# EAGLE design BIM Test Shield (EAGLE 5.12)
AUTHORNAME: Aaron Bonnell-Kangas; BOARDNAME: BIM Test Shield; BOM: EXCLUDE; DATABASE: ../../../../Component libraries/partsdb.txt; RELEASE: RELEASE; REVISIONDATE: v1.0.0 - 2015-04-29; TP_NAME: 4-VBAT

## Sheet 1 of 2
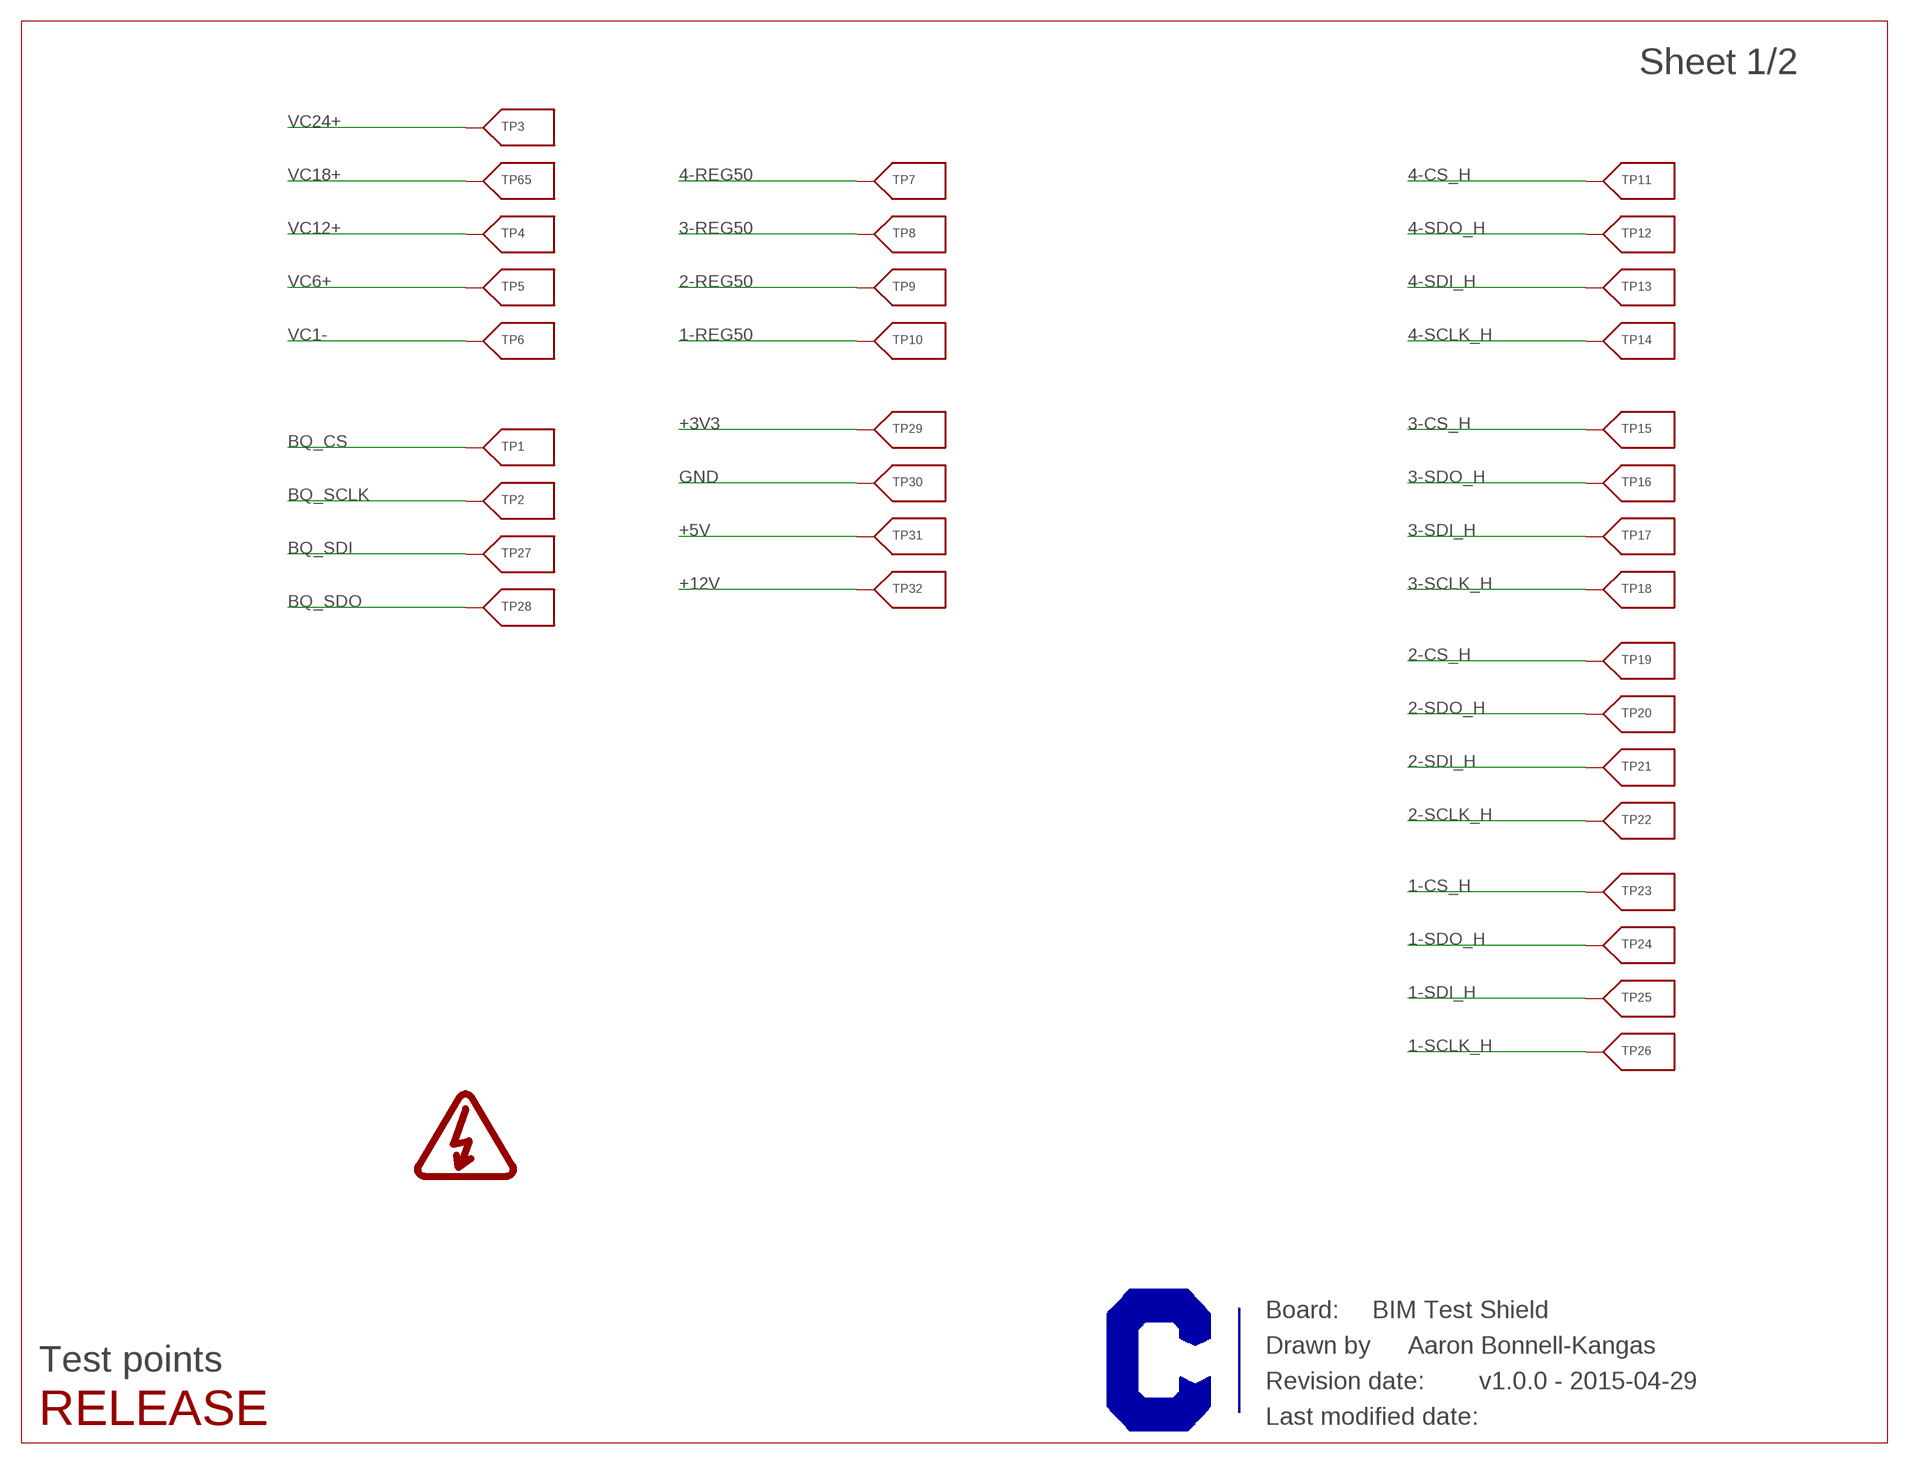
[diagram p0: schematic, sheet 1]

### Parts
TP1  SMD_TEST_POINT-POGO_PIN  [POGO-PIN_MILL-MAX_0908-X]
TP2  SMD_TEST_POINT-POGO_PIN  [POGO-PIN_MILL-MAX_0908-X]
TP3  SMD_TEST_POINT-POGO_PIN  [POGO-PIN_MILL-MAX_0908-X]
TP4  SMD_TEST_POINT-POGO_PIN  [POGO-PIN_MILL-MAX_0908-X]
TP5  SMD_TEST_POINT-POGO_PIN  [POGO-PIN_MILL-MAX_0908-X]
TP6  SMD_TEST_POINT-POGO_PIN  [POGO-PIN_MILL-MAX_0908-X]
TP7  SMD_TEST_POINT-POGO_PIN  [POGO-PIN_MILL-MAX_0908-X]
TP8  SMD_TEST_POINT-POGO_PIN  [POGO-PIN_MILL-MAX_0908-X]
TP9  SMD_TEST_POINT-POGO_PIN  [POGO-PIN_MILL-MAX_0908-X]
TP10  SMD_TEST_POINT-POGO_PIN  [POGO-PIN_MILL-MAX_0908-X]
TP11  SMD_TEST_POINT-POGO_PIN  [POGO-PIN_MILL-MAX_0908-X]
TP12  SMD_TEST_POINT-POGO_PIN  [POGO-PIN_MILL-MAX_0908-X]
TP13  SMD_TEST_POINT-POGO_PIN  [POGO-PIN_MILL-MAX_0908-X]
TP14  SMD_TEST_POINT-POGO_PIN  [POGO-PIN_MILL-MAX_0908-X]
TP15  SMD_TEST_POINT-POGO_PIN  [POGO-PIN_MILL-MAX_0908-X]
TP16  SMD_TEST_POINT-POGO_PIN  [POGO-PIN_MILL-MAX_0908-X]
TP17  SMD_TEST_POINT-POGO_PIN  [POGO-PIN_MILL-MAX_0908-X]
TP18  SMD_TEST_POINT-POGO_PIN  [POGO-PIN_MILL-MAX_0908-X]
TP19  SMD_TEST_POINT-POGO_PIN  [POGO-PIN_MILL-MAX_0908-X]
TP20  SMD_TEST_POINT-POGO_PIN  [POGO-PIN_MILL-MAX_0908-X]
TP21  SMD_TEST_POINT-POGO_PIN  [POGO-PIN_MILL-MAX_0908-X]
TP22  SMD_TEST_POINT-POGO_PIN  [POGO-PIN_MILL-MAX_0908-X]
TP23  SMD_TEST_POINT-POGO_PIN  [POGO-PIN_MILL-MAX_0908-X]
TP24  SMD_TEST_POINT-POGO_PIN  [POGO-PIN_MILL-MAX_0908-X]
TP25  SMD_TEST_POINT-POGO_PIN  [POGO-PIN_MILL-MAX_0908-X]
TP26  SMD_TEST_POINT-POGO_PIN  [POGO-PIN_MILL-MAX_0908-X]
TP27  SMD_TEST_POINT-POGO_PIN  [POGO-PIN_MILL-MAX_0908-X]
TP28  SMD_TEST_POINT-POGO_PIN  [POGO-PIN_MILL-MAX_0908-X]
TP29  SMD_TEST_POINT-POGO_PIN  [POGO-PIN_MILL-MAX_0908-X]
TP30  SMD_TEST_POINT-POGO_PIN  [POGO-PIN_MILL-MAX_0908-X]
TP31  SMD_TEST_POINT-POGO_PIN  [POGO-PIN_MILL-MAX_0908-X]
TP32  SMD_TEST_POINT-POGO_PIN  [POGO-PIN_MILL-MAX_0908-X]
TP65  SMD_TEST_POINT-POGO_PIN  [POGO-PIN_MILL-MAX_0908-X]
U$1  HV_SYMBOL  [HV_SYMBOL]

### Nets
1-CS_H: TP23.P$1 ; also sheet 2
1-REG50: TP10.P$1 ; also sheet 2
1-SCLK_H: TP26.P$1 ; also sheet 2
1-SDI_H: TP25.P$1 ; also sheet 2
1-SDO_H: TP24.P$1 ; also sheet 2
2-CS_H: TP19.P$1 ; also sheet 2
2-REG50: TP9.P$1 ; also sheet 2
2-SCLK_H: TP22.P$1 ; also sheet 2
2-SDI_H: TP21.P$1 ; also sheet 2
2-SDO_H: TP20.P$1 ; also sheet 2
3-CS_H: TP15.P$1 ; also sheet 2
3-REG50: TP8.P$1 ; also sheet 2
3-SCLK_H: TP18.P$1 ; also sheet 2
3-SDI_H: TP17.P$1 ; also sheet 2
3-SDO_H: TP16.P$1 ; also sheet 2
4-CS_H: TP11.P$1 ; also sheet 2
4-REG50: TP7.P$1 ; also sheet 2
4-SCLK_H: TP14.P$1 ; also sheet 2
4-SDI_H: TP13.P$1 ; also sheet 2
4-SDO_H: TP12.P$1 ; also sheet 2
+3V3 [LV]: TP29.P$1 ; also sheet 2
+5V: TP31.P$1 ; also sheet 2
+12V: TP32.P$1 ; also sheet 2
BQ_CS: TP1.P$1 ; also sheet 2
BQ_SCLK: TP2.P$1 ; also sheet 2
BQ_SDI: TP27.P$1 ; also sheet 2
BQ_SDO: TP28.P$1 ; also sheet 2
GND [LV]: TP30.P$1 ; also sheet 2
VC1- [HV]: TP6.P$1 ; also sheet 2
VC6+ [HV]: TP5.P$1 ; also sheet 2
VC12+ [HV]: TP4.P$1 ; also sheet 2
VC18+: TP65.P$1 ; also sheet 2
VC24+ [HV]: TP3.P$1 ; also sheet 2

### Notes on the sheet
- BIM Test Shield
- Aaron Bonnell-Kangas
- Test points
- v1.0.0 - 2015-04-29

## Sheet 2 of 2
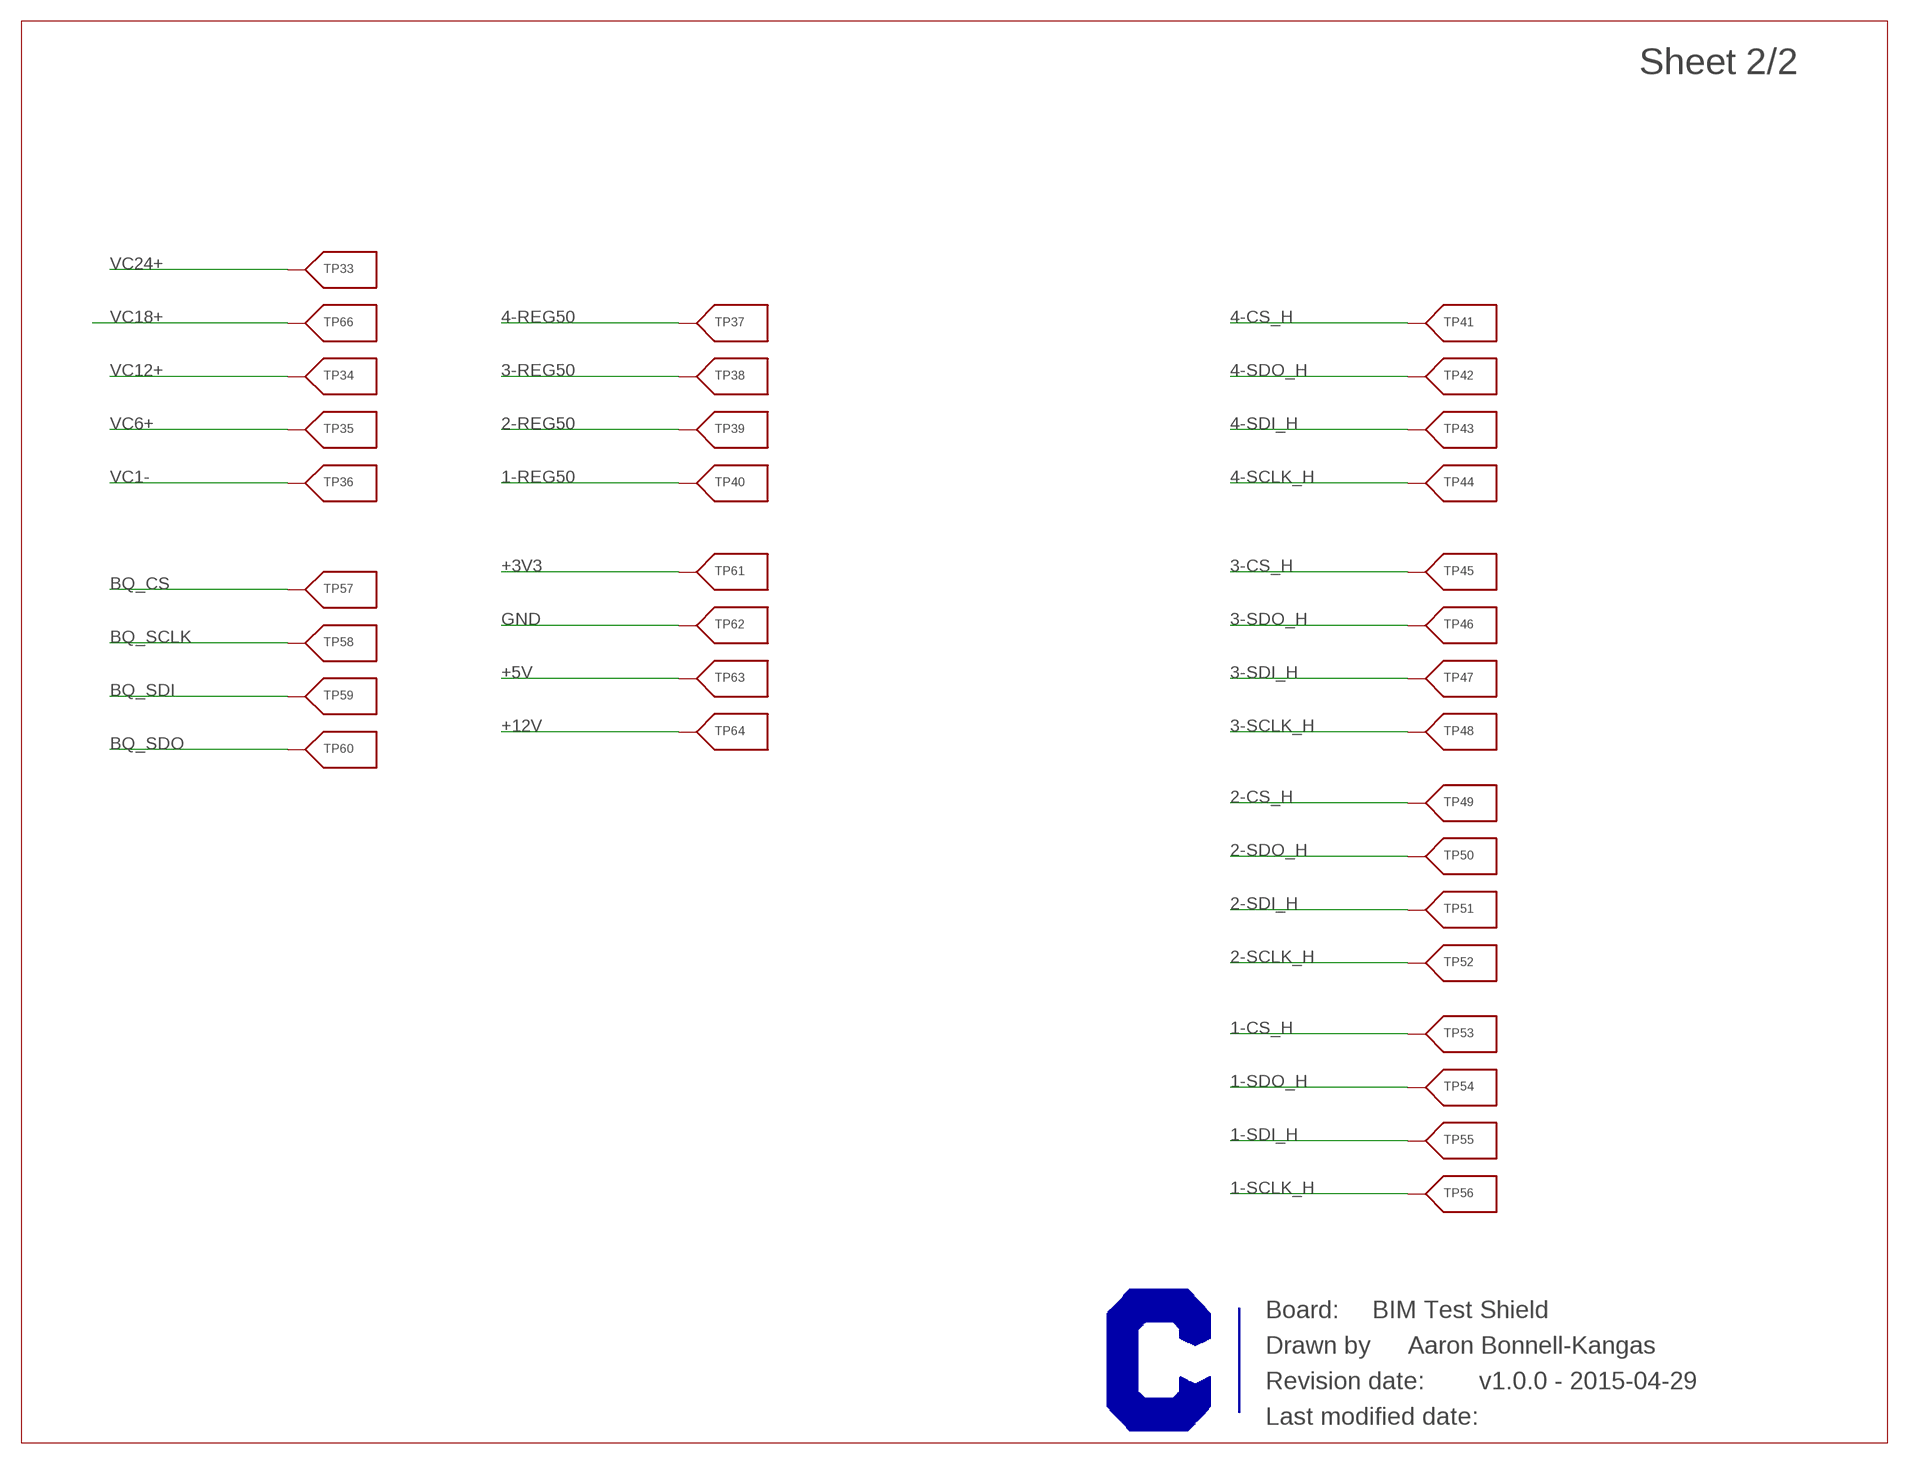
[diagram p1: schematic, sheet 2]

### Parts
TP33  VC24+  SMD_TEST_POINT-TEST_CLIP  [MINI_TEST_POINT]
TP34  VC12+  SMD_TEST_POINT-TEST_CLIP  [MINI_TEST_POINT]
TP35  VC6+  SMD_TEST_POINT-TEST_CLIP  [MINI_TEST_POINT]
TP36  VC1-  SMD_TEST_POINT-TEST_CLIP  [MINI_TEST_POINT]
TP37  4-REG50  SMD_TEST_POINT-TEST_CLIP  [MINI_TEST_POINT]
TP38  3-REG50  SMD_TEST_POINT-TEST_CLIP  [MINI_TEST_POINT]
TP39  2-REG50  SMD_TEST_POINT-TEST_CLIP  [MINI_TEST_POINT]
TP40  1-REG50  SMD_TEST_POINT-TEST_CLIP  [MINI_TEST_POINT]
TP41  4-CS_H  SMD_TEST_POINT-TEST_CLIP  [MINI_TEST_POINT]
TP42  4-SDO_H  SMD_TEST_POINT-TEST_CLIP  [MINI_TEST_POINT]
TP43  4-SDI_H  SMD_TEST_POINT-TEST_CLIP  [MINI_TEST_POINT]
TP44  4-SCLK_H  SMD_TEST_POINT-TEST_CLIP  [MINI_TEST_POINT]
TP45  3-CS_H  SMD_TEST_POINT-TEST_CLIP  [MINI_TEST_POINT]
TP46  3-SDO_H  SMD_TEST_POINT-TEST_CLIP  [MINI_TEST_POINT]
TP47  3_SDI_H  SMD_TEST_POINT-TEST_CLIP  [MINI_TEST_POINT]
TP48  3-SCLK_H  SMD_TEST_POINT-TEST_CLIP  [MINI_TEST_POINT]
TP49  2-CS_H  SMD_TEST_POINT-TEST_CLIP  [MINI_TEST_POINT]
TP50  2-SDO_H  SMD_TEST_POINT-TEST_CLIP  [MINI_TEST_POINT]
TP51  2-SDI_H  SMD_TEST_POINT-TEST_CLIP  [MINI_TEST_POINT]
TP52  2-SCLK_H  SMD_TEST_POINT-TEST_CLIP  [MINI_TEST_POINT]
TP53  1-CS_H  SMD_TEST_POINT-TEST_CLIP  [MINI_TEST_POINT]
TP54  1-SDO_H  SMD_TEST_POINT-TEST_CLIP  [MINI_TEST_POINT]
TP55  1-SDI_H  SMD_TEST_POINT-TEST_CLIP  [MINI_TEST_POINT]
TP56  1-SCLK_H  SMD_TEST_POINT-TEST_CLIP  [MINI_TEST_POINT]
TP57  BQ_CS  SMD_TEST_POINT-TEST_CLIP  [MINI_TEST_POINT]
TP58  BQ_SCLK  SMD_TEST_POINT-TEST_CLIP  [MINI_TEST_POINT]
TP59  BQ_SDI  SMD_TEST_POINT-TEST_CLIP  [MINI_TEST_POINT]
TP60  BQ_SDO  SMD_TEST_POINT-TEST_CLIP  [MINI_TEST_POINT]
TP61  +3V3  SMD_TEST_POINT-TEST_CLIP  [MINI_TEST_POINT]
TP62  GND  SMD_TEST_POINT-TEST_CLIP  [MINI_TEST_POINT]
TP63  +5V  SMD_TEST_POINT-TEST_CLIP  [MINI_TEST_POINT]
TP64  +12V  SMD_TEST_POINT-TEST_CLIP  [MINI_TEST_POINT]
TP66  VC18+  SMD_TEST_POINT-TEST_CLIP  [MINI_TEST_POINT]

### Nets
1-CS_H: TP53.P$1 ; also sheet 1
1-REG50: TP40.P$1 ; also sheet 1
1-SCLK_H: TP56.P$1 ; also sheet 1
1-SDI_H: TP55.P$1 ; also sheet 1
1-SDO_H: TP54.P$1 ; also sheet 1
2-CS_H: TP49.P$1 ; also sheet 1
2-REG50: TP39.P$1 ; also sheet 1
2-SCLK_H: TP52.P$1 ; also sheet 1
2-SDI_H: TP51.P$1 ; also sheet 1
2-SDO_H: TP50.P$1 ; also sheet 1
3-CS_H: TP45.P$1 ; also sheet 1
3-REG50: TP38.P$1 ; also sheet 1
3-SCLK_H: TP48.P$1 ; also sheet 1
3-SDI_H: TP47.P$1 ; also sheet 1
3-SDO_H: TP46.P$1 ; also sheet 1
4-CS_H: TP41.P$1 ; also sheet 1
4-REG50: TP37.P$1 ; also sheet 1
4-SCLK_H: TP44.P$1 ; also sheet 1
4-SDI_H: TP43.P$1 ; also sheet 1
4-SDO_H: TP42.P$1 ; also sheet 1
+3V3 [LV]: TP61.P$1 ; also sheet 1
+5V: TP63.P$1 ; also sheet 1
+12V: TP64.P$1 ; also sheet 1
BQ_CS: TP57.P$1 ; also sheet 1
BQ_SCLK: TP58.P$1 ; also sheet 1
BQ_SDI: TP59.P$1 ; also sheet 1
BQ_SDO: TP60.P$1 ; also sheet 1
GND [LV]: TP62.P$1 ; also sheet 1
VC1- [HV]: TP36.P$1 ; also sheet 1
VC6+ [HV]: TP35.P$1 ; also sheet 1
VC12+ [HV]: TP34.P$1 ; also sheet 1
VC18+: TP66.P$1 ; also sheet 1
VC24+ [HV]: TP33.P$1 ; also sheet 1

### Notes on the sheet
- BIM Test Shield
- Aaron Bonnell-Kangas
- v1.0.0 - 2015-04-29

## Library data of the parts
TP1-TP32 TP65 = Test points:SMD_TEST_POINT; PARTNO: 0908-2-15-20-75-14-11-0
TP33-TP64 TP66 = Test points:SMD_TEST_POINT
U$1 = Logos:HV_SYMBOL; BOM: EXCLUDE

## Net classes
1 HV: clearance 0.1 mm
2 LV: clearance 1 mm to class 1

## Board
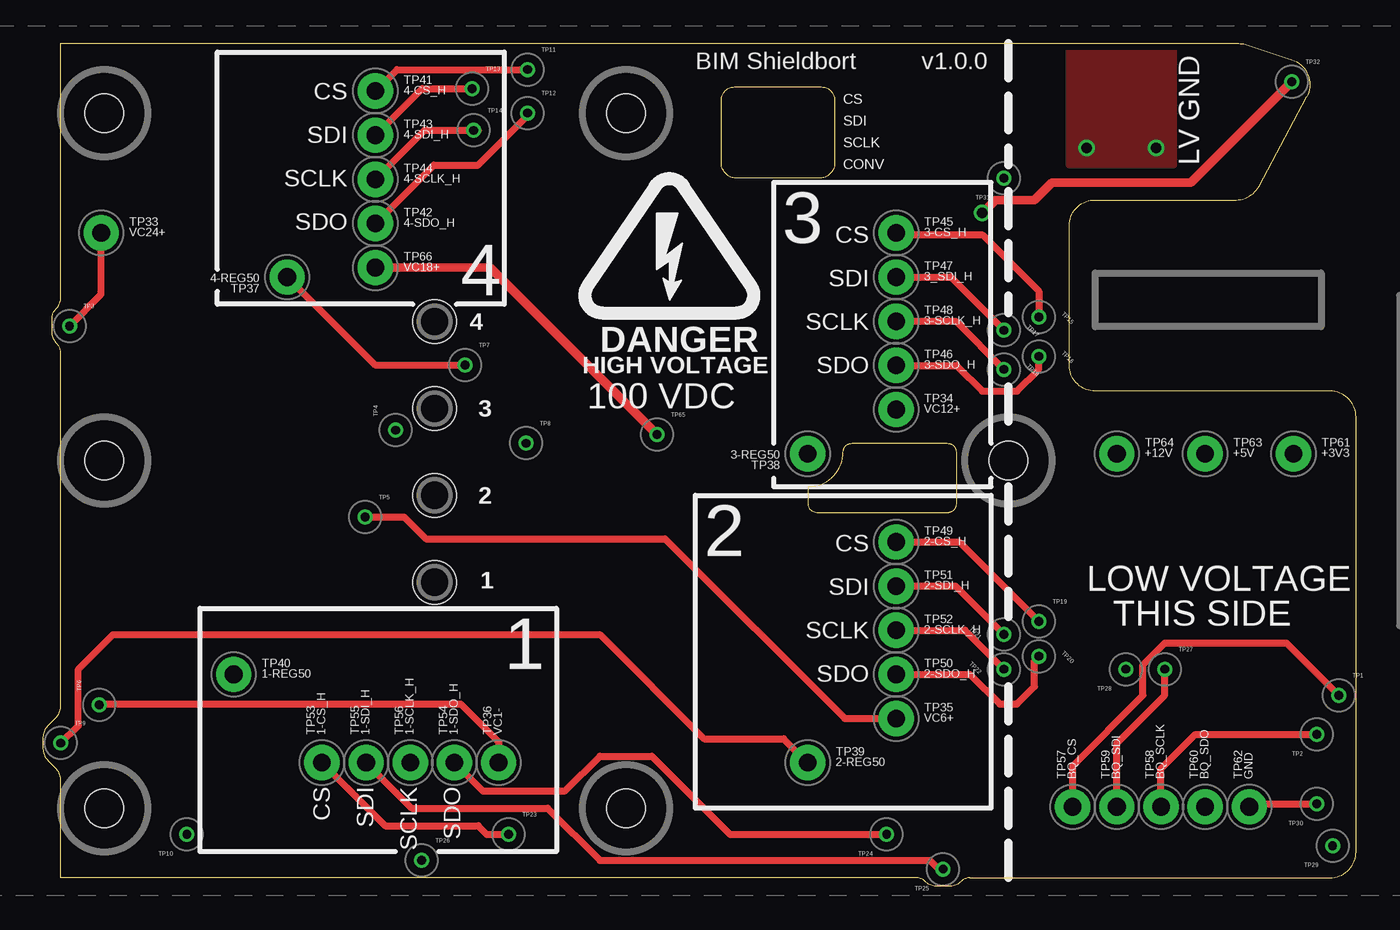
[diagram p2: board, top side]
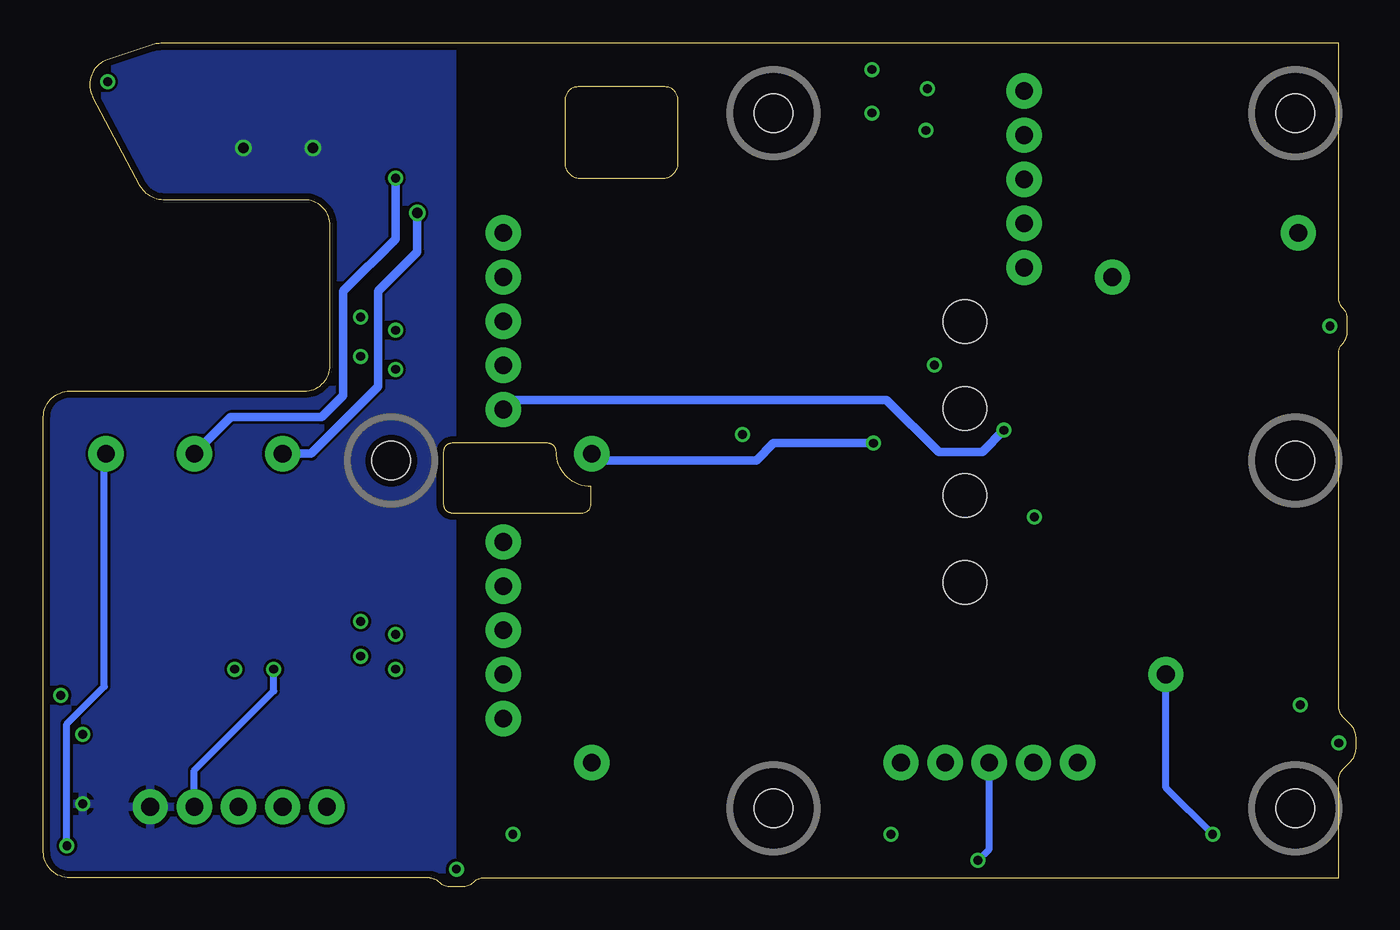
[diagram p3: board, bottom side, seen from below]

Size 75.5 x 48.5 mm. Coordinates in mm from the lower left corner, seen from the top.
Outline: 1,48.5 68.76,48.5 arc-18 69.23,48.42 71.81,47.56 arc-100 72.66,45.43 69.92,40.29 arc-62 68.6,39.5 60.5,39.5 arc90 59,38 59,30 arc90 60.5,28.5 74,28.5 arc-90 75.5,27 75.5,2 arc-90 74,0.5 53.29,0.5 arc45 52.79,0.29 arc-45 52.09,0 51.41,0 arc-45 50.71,0.29 arc45 50.21,0.5 1,0.5 1,6.09 arc45 0.71,6.79 0.29,7.21 arc-45 0,7.91 0,8.59 arc-45 0.29,9.29 0.71,9.71 arc45 1,10.41 1,30.71 arc45 0.79,31.21 arc-45 0.5,31.91 0.5,32.71 arc-45 0.71,33.21 arc45 1,33.91 1,48.5
Outline: 44,23 arc90 46,25 arc-90 46.5,25.5 52,25.5 arc-90 52.5,25 52.5,22 arc-90 52,21.5 44.5,21.5 arc-90 44,22 44,23
Outline: 45.5,41.75 arc-90 44.75,40.75 39.75,40.75 arc-90 39,41.75 39,45.25 arc-90 39.75,46 44.75,46 arc-90 45.5,45.25 45.5,41.75
Copper layers (1*16): Top 0.0356mm / dielectric 1.5011mm / Bottom 0.0356mm
Design rules "OSH Park 2-layer": minimum track width 6mil, minimum drill 13mil, track to track 6mil, track to pad 6mil, pad to pad 6mil, via to via 6mil, smd to smd 6mil, copper to edge 15mil, drill to drill 6mil, minimum pad ring 7mil, minimum via ring 7mil, stop-mask expansion 4mil, vias tented up to drill 25mil, thermal gap 10mil
Holes 2.2 mm at 55.5,24.5 3.5,4.5 3.5,44.5 3.5,24.5 33.5,44.5 33.5,4.5
Holes 2.5 mm at 22.5,27.5 22.5,22.5 22.5,17.5 22.5,32.5
tKeepout: area -17,48.2 to 45.5,49.5; area -17,-0.5 to 45.5,0.8; area 85.5,36 to 90.5,49.5; area 85.5,-0.5 to 90.5,13
bKeepout: area 53,22 to 58,27; area 31.5,2.5 to 35.5,6.5; area 1,2 to 6,7; area 1,42 to 6,47; area 1.5,22.5 to 5.5,26.5; area 31.5,42.5 to 35.5,46.5

### Footprints (pad centres in the part's own frame; a part is rotated, then mirrored left to right if it is on the bottom)
POGO-PIN_MILL-MAX_0908-X = drill 0.508 round: P$1 0,0
MINI_TEST_POINT = drill 1.016 pad 2.032 round: P$1 0,0

### Placement (x,y rotation side)
TP1  74.5,11 0 top
TP2  73.25,8.75 180 top
TP3  1.5,32.25 0 top
TP4  20.25,26.25 90 top
TP5  18.5,21.25 0 top
TP6  3.2,10.45 90 top
TP7  24.25,30 0 top
TP8  27.75,25.5 0 top
TP9  1,8.25 0 top
TP10  8.25,3 180 top
TP11  27.85,47 0 top
TP12  27.85,44.5 0 top
TP13  24.65,45.9 0 top
TP14  24.75,43.5 0 top
TP15  57.25,32.75 315 top
TP16  57.25,30.5 315 top
TP17  55.25,32 315 top
TP18  55.25,29.75 315 top
TP19  57.25,15.25 0 top
TP20  57.25,13.25 315 top
TP21  55.25,14.5 135 top
TP22  55.25,12.5 135 top
TP23  26.75,3 0 top
TP24  48.5,3 180 top
TP25  51.75,1 180 top
TP26  21.75,1.5 0 top
TP27  64.5,12.5 0 top
TP28  62.25,12.5 180 top
TP29  74.15,2.35 180 top
TP30  73.25,4.75 180 top
TP31  55.25,40.75 180 top
TP32  71.8,46.3 0 top
TP33  3.32,37.6 0 top
TP34  49.04,27.44 0 top
TP35  49.04,9.66 0 top
TP36  26.18,7.12 90 top
TP37  14.02,35.06 180 top
TP38  43.96,24.9 180 top
TP39  43.96,7.12 0 top
TP40  10.94,12.2 0 top
TP41  19.1,45.76 0 top
TP42  19.1,38.14 0 top
TP43  19.1,43.22 0 top
TP44  19.1,40.68 0 top
TP45  49.04,37.6 0 top
TP46  49.04,29.98 0 top
TP47  49.04,35.06 0 top
TP48  49.04,32.52 0 top
TP49  49.04,19.82 0 top
TP50  49.04,12.2 0 top
TP51  49.04,17.28 0 top
TP52  49.04,14.74 0 top
TP53  16.02,7.12 90 top
TP54  23.64,7.12 90 top
TP55  18.56,7.12 90 top
TP56  21.1,7.12 90 top
TP57  59.2,4.58 90 top
TP58  64.28,4.58 90 top
TP59  61.74,4.58 90 top
TP60  66.82,4.58 90 top
TP61  71.9,24.9 0 top
TP62  69.36,4.58 90 top
TP63  66.82,24.9 0 top
TP64  61.74,24.9 0 top
TP65  35.3,26 0 top
TP66  19.1,35.6 0 top
U$1  36,38 0 top

### Tracks (layer width: path | path; a pad name or v marks a point on that pad's centre or on a via)
1-CS_H
  Top 0.406: TP53.P$1 19.64,3.5 25,3.5 25.5,3 TP23.P$1
1-REG50
  Bottom 0.406: TP10.P$1 10.94,5.69 TP40.P$1
1-SCLK_H
  Bottom 0.406: TP26.P$1 21.1,2.15 TP56.P$1
1-SDI_H
  Top 0.406: TP55.P$1 21.18,4.5 29,4.5 32,1.5 51,1.5 51.5,1 TP25.P$1
1-SDO_H
  Top 0.406: TP54.P$1 25.26,5.5 30,5.5 32,7.5 35,7.5 39.5,3 TP24.P$1
2-CS_H
  Top 0.406: TP49.P$1 52.68,19.82 TP19.P$1
2-REG50
  Top 0.406: TP39.P$1 42.58,8.5 38,8.5 32,14.5 4,14.5 2,12.5 2,9.25 TP9.P$1
2-SCLK_H
  Top 0.406: TP52.P$1 53.01,14.74 TP22.P$1
2-SDI_H
  Top 0.406: TP51.P$1 52.47,17.28 TP21.P$1
2-SDO_H
  Top 0.406: TP50.P$1 53.3,12.2 55,10.5 56,10.5 57,11.5 57,13 TP20.P$1
3-CS_H
  Top 0.406: TP15.P$1 57.25,34.25 54,37.5 49.14,37.5 TP45.P$1
3-REG50
  Bottom 0.5: TP8.P$1 33.5,25.5 34.5,24.5 43.56,24.5 TP38.P$1
3-SCLK_H
  Top 0.406: TP18.P$1 52.48,32.52 TP48.P$1
3-SDI_H
  Top 0.406: TP17.P$1 52.19,35.06 TP47.P$1
3-SDO_H
  Top 0.406: TP16.P$1 57.25,29.75 56,28.5 54,28.5 52.52,29.98 TP46.P$1
4-CS_H
  Top 0.406: TP41.P$1 20.34,47 TP11.P$1
4-REG50
  Top 0.406: TP37.P$1 19.08,30 TP7.P$1
4-SCLK_H
  Top 0.406: TP44.P$1 21.92,43.5 TP14.P$1 25,43.5
4-SDI_H
  Top 0.406: TP43.P$1 21.78,45.9 TP13.P$1
4-SDO_H
  Top 0.406: TP42.P$1 22.46,41.5 25,41.5 27.85,44.35 TP12.P$1
+3V3
  Bottom 0.406: TP29.P$1 74.15,9.35 72,11.5 72,24.8 TP61.P$1
+5V
  Bottom 0.5: TP31.P$1 55.25,37.25 58.25,34.25 58.25,28.25 59.5,27 64.72,27 TP63.P$1
+12V  (via drill 0.6)
  Top 0.5: v54,38.75 54.75,39.5 57,39.5 58,40.5 66,40.5 TP32.P$1
  Bottom 0.5: TP64.P$1 60.1,24.9 56.25,28.75 56.25,34.25 54,36.5 v54,38.75
BQ_CS
  Top 0.406: TP57.P$1 59.2,6.95 63.25,11 63.25,12.75 64.5,14 71.5,14 TP1.P$1
BQ_SCLK
  Top 0.406: TP58.P$1 64.28,6.78 66.25,8.75 TP2.P$1
BQ_SDI
  Top 0.406: TP59.P$1 61.74,8.24 64.5,11 TP27.P$1
BQ_SDO
  Bottom 0.406: TP60.P$1 66.82,6.68 62.25,11.25 TP28.P$1
GND  (via drill 0.6)
  Top 0.406: TP62.P$1 69.53,4.75 TP30.P$1
  other vias: 60,42.5 64,42.5
  pour Top: 59,48.5 65,48.5 65,41.5 59,41.5
  pour Bottom: 52,48.5 77,48.5 77,0.5 52,0.5
VC1-
  Top 0.406: TP6.P$1 3.25,10.5 24,10.5 26.18,8.32 TP36.P$1
VC6+
  Top 0.406: TP5.P$1 20.75,21.25 22,20 35.75,20 46.09,9.66 TP35.P$1
VC12+
  Bottom 0.5: TP4.P$1 21.5,25 24,25 27,28 48.48,28 TP34.P$1
VC18+
  Top 0.5: TP66.P$1 25.7,35.6 TP65.P$1
VC24+
  Top 0.406: TP33.P$1 3.32,34.07 TP3.P$1

### Text on the board
tPlace: BIM Shieldbort | v1.0.0 | CS | CS | SDI | SDI | SCLK | SCLK | CONV | LV GND | SDO | 3 | CS | SDI | 4 | SCLK | 4 | DANGER | SDO | HIGH VOLTAGE | 3 | 100 VDC | 2 | CS | 2 | 1 | SDI | LOW VOLTAGE | SCLK | THIS SIDE | 1 | SDO | CS | SDI | SCLK | SDO
Document: BIM Test Shield | v1.0.0 | Aaron Bonnell-Kangas
tDocu: JTAG | CAN conn